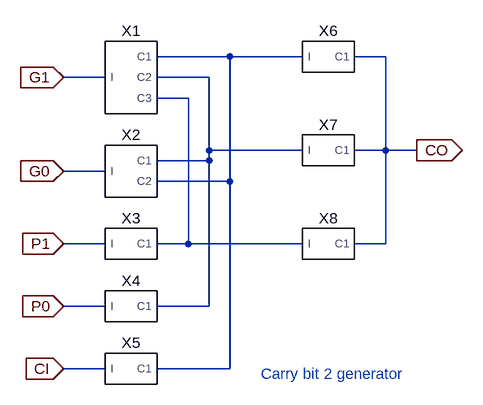
[diagram p0: schematic cla2.asc]
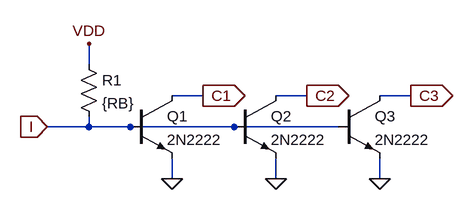
[diagram p1: sub-circuit iilg3.asc]
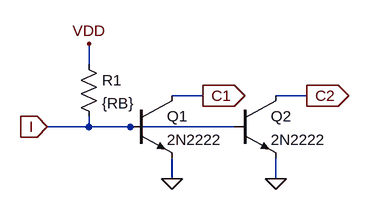
[diagram p2: sub-circuit iilg2.asc]
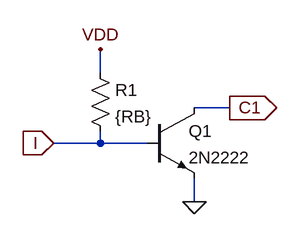
[diagram p3: sub-circuit iilg1.asc]
cla2.asc, the LTspice schematic file:
Version 4
SHEET 1 1856 1728
WIRE 464 -208 352 -208
WIRE 576 -208 464 -208
WIRE 704 -208 656 -208
WIRE 272 -176 208 -176
WIRE 432 -176 352 -176
WIRE 400 -144 352 -144
WIRE 432 -64 432 -176
WIRE 576 -64 432 -64
WIRE 704 -64 704 -208
WIRE 704 -64 656 -64
WIRE 752 -64 704 -64
WIRE 432 -48 432 -64
WIRE 432 -48 352 -48
WIRE 272 -32 208 -32
WIRE 464 -16 464 -208
WIRE 464 -16 352 -16
WIRE 272 80 208 80
WIRE 400 80 400 -144
WIRE 400 80 352 80
WIRE 576 80 400 80
WIRE 704 80 704 -64
WIRE 704 80 656 80
WIRE 272 176 208 176
WIRE 432 176 432 -48
WIRE 432 176 352 176
WIRE 272 272 208 272
WIRE 464 272 464 -16
WIRE 464 272 352 272
FLAG 208 272 CI
IOPIN 208 272 In
FLAG 208 -176 G1
IOPIN 208 -176 In
FLAG 208 176 P0
IOPIN 208 176 In
FLAG 752 -64 CO
IOPIN 752 -64 Out
FLAG 208 -32 G0
IOPIN 208 -32 In
FLAG 208 80 P1
IOPIN 208 80 In
SYMBOL iilg3 304 -176 R0
SYMATTR InstName X1
SYMBOL iilg2 304 -32 R0
SYMATTR InstName X2
SYMBOL iilg1 304 80 R0
SYMATTR InstName X3
SYMBOL iilg1 304 176 R0
SYMATTR InstName X4
SYMBOL iilg1 304 272 R0
SYMATTR InstName X5
SYMBOL iilg1 608 -208 R0
SYMATTR InstName X6
SYMBOL iilg1 608 -64 R0
SYMATTR InstName X7
SYMBOL iilg1 608 80 R0
SYMATTR InstName X8
TEXT 512 280 Left 2 ;Carry bit 2 generator

iilg3.asc, the sub-circuit schematic file:
Version 4
SHEET 1 956 680
WIRE 384 240 384 208
WIRE 560 288 512 288
WIRE 720 288 672 288
WIRE 880 288 832 288
WIRE 384 336 384 320
WIRE 384 336 320 336
WIRE 448 336 384 336
WIRE 608 336 448 336
WIRE 768 336 608 336
WIRE 512 416 512 384
WIRE 672 416 672 384
WIRE 832 416 832 384
FLAG 384 208 VDD
FLAG 320 336 I
IOPIN 320 336 In
FLAG 512 416 0
FLAG 560 288 C1
IOPIN 560 288 Out
FLAG 672 416 0
FLAG 720 288 C2
IOPIN 720 288 Out
FLAG 832 416 0
FLAG 880 288 C3
IOPIN 880 288 Out
SYMBOL npn 448 288 R0
SYMATTR InstName Q1
SYMATTR Value 2N2222
SYMBOL res 368 224 R0
SYMATTR InstName R1
SYMATTR Value {RB}
SYMBOL npn 608 288 R0
SYMATTR InstName Q2
SYMATTR Value 2N2222
SYMBOL npn 768 288 R0
SYMATTR InstName Q3
SYMATTR Value 2N2222

iilg2.asc, the sub-circuit schematic file:
Version 4
SHEET 1 880 680
WIRE 384 240 384 208
WIRE 560 288 512 288
WIRE 720 288 672 288
WIRE 384 336 384 320
WIRE 384 336 320 336
WIRE 448 336 384 336
WIRE 608 336 448 336
WIRE 512 416 512 384
WIRE 672 416 672 384
FLAG 384 208 VDD
FLAG 320 336 I
IOPIN 320 336 In
FLAG 512 416 0
FLAG 560 288 C1
IOPIN 560 288 Out
FLAG 672 416 0
FLAG 720 288 C2
IOPIN 720 288 Out
SYMBOL npn 448 288 R0
SYMATTR InstName Q1
SYMATTR Value 2N2222
SYMBOL res 368 224 R0
SYMATTR InstName R1
SYMATTR Value {RB}
SYMBOL npn 608 288 R0
SYMATTR InstName Q2
SYMATTR Value 2N2222

iilg1.asc, the sub-circuit schematic file:
Version 4
SHEET 1 880 680
WIRE 384 240 384 208
WIRE 560 288 512 288
WIRE 384 336 384 320
WIRE 384 336 320 336
WIRE 448 336 384 336
WIRE 512 416 512 384
FLAG 512 416 0
FLAG 384 208 VDD
FLAG 320 336 I
IOPIN 320 336 In
FLAG 560 288 C1
IOPIN 560 288 Out
SYMBOL npn 448 288 R0
SYMATTR InstName Q1
SYMATTR Value 2N2222
SYMBOL res 368 224 R0
SYMATTR InstName R1
SYMATTR Value {RB}

The netlist it stands for:
* cla2.asc
XX1 G1 N001 N002 N003 iilg3
XX2 G0 N002 N001 iilg2
XX3 P1 N003 iilg1
XX4 P0 N002 iilg1
XX5 CI N001 iilg1
XX6 N001 CO iilg1
XX7 N002 CO iilg1
XX8 N003 CO iilg1

* block symbol definitions
.subckt iilg3 I C1 C2 C3
Q1 C1 I 0 0 2N2222
R1 VDD I {RB}
Q2 C2 I 0 0 2N2222
Q3 C3 I 0 0 2N2222
.ends iilg3

.subckt iilg2 I C1 C2
Q1 C1 I 0 0 2N2222
R1 VDD I {RB}
Q2 C2 I 0 0 2N2222
.ends iilg2

.subckt iilg1 I C1
Q1 C1 I 0 0 2N2222
R1 VDD I {RB}
.ends iilg1

.model NPN NPN
.model PNP PNP
.lib standard.bjt
* Carry bit 2 generator
.backanno
.end